# EAGLE schematic esp32 (EAGLE 9.3.0)
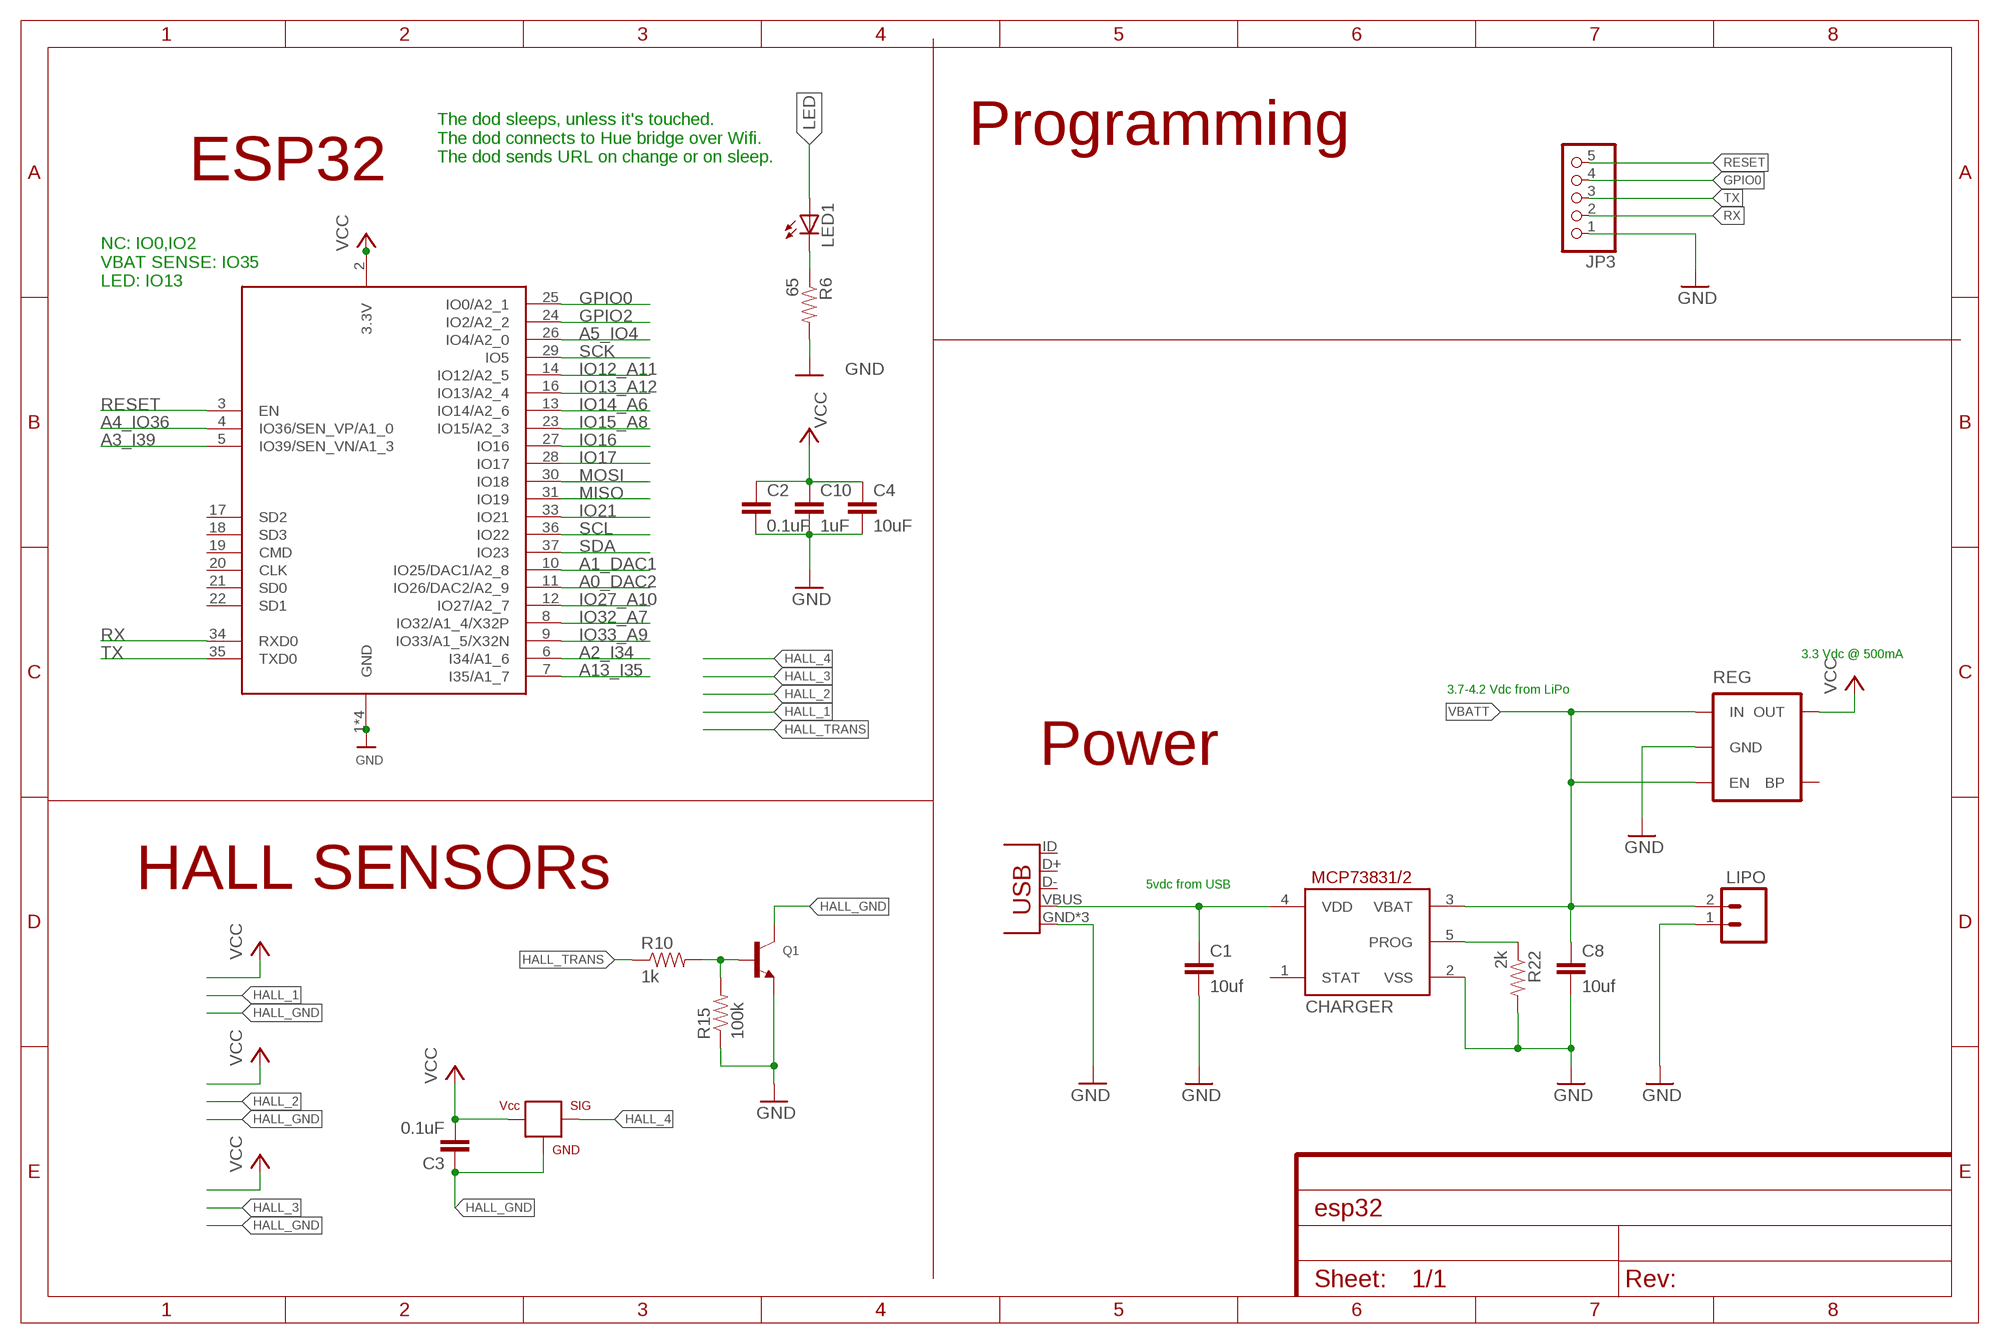
[diagram p0: schematic, sheet 1]

## Parts
C1  10uf  CAP0603-CAP  [0603-CAP]
C2  0.1uF  CAP0402-CAP  [0402-CAP]
C3  0.1uF  CAP0603-CAP  [0603-CAP]
C4  10uF  CAP0402-CAP  [0402-CAP]
C8  10uf  CAP0603-CAP  [0603-CAP]
C10  1uF  CAP0402-CAP  [0402-CAP]
CHARGER  MCP73831/OT  [SOT23-5L]
HALL  HALLEFFECT-A1326  [SOT23-3]
JP1  USB-MICROB  [USB-MICROB]
JP3  PINHD-1X55X2MM  [1_05X2MM]
LED1  LEDCHIPLED_0603  [CHIPLED_0603]
LIPO  M02  [1X02_LONGPADS]
Q1  TRANSISTOR_NPN  [SOT-23-R]
R6  65  RESISTOR0805-RES  [0805]
R10  1k  RESISTOR0402-RES  [0402-RES]
R15  100k  RESISTOR0402-RES  [0402-RES]
R22  2k  RESISTOR0402-RES  [0402-RES]
REG  MIC52053.3V  [SOT23-5]
X2  ESP32_WROOM32_SKINNY  [WROOM32_SKINNY]

## Nets
5V: C1.1 CHARGER.4(VDD) JP1.VBUS
A0_DAC2: X2.11(IO26/DAC2/A2_9)
A1_DAC1: X2.10(IO25/DAC1/A2_8)
A2_I34: X2.6(I34/A1_6)
A3_I39: X2.5(IO39/SEN_VN/A1_3)
A4_IO36: X2.4(IO36/SEN_VP/A1_0)
A5_IO4: X2.26(IO4/A2_0)
A13_I35: X2.7(I35/A1_7)
GND: C1.2 C2.2 C4.2 C8.2 C10.2 CHARGER.2(VSS) JP1.GND JP1.MT1(GND) JP1.MT2(GND) JP3.1 LIPO.1 Q1.3-EMITTER(E) R6.2 R15.1 R22.2 REG.2(GND) X2.1(GND) X2.15(GND) X2.38(GND) X2.P$1(GND)
GPIO0: JP3.4 X2.25(IO0/A2_1)
GPIO2: X2.24(IO2/A2_2)
HALL_4: HALL.2(SIG)
HALL_GND: C3.1 HALL.3(GND) Q1.2-COLLECTOR(C)
HALL_TRANS: R10.1
IO12_A11: X2.14(IO12/A2_5)
IO13_A12: X2.16(IO13/A2_4)
IO14_A6: X2.13(IO14/A2_6)
IO15_A8: X2.23(IO15/A2_3)
IO16: X2.27(IO16)
IO17: X2.28(IO17)
IO21: X2.33(IO21)
IO27_A10: X2.12(IO27/A2_7)
IO32_A7: X2.8(IO32/A1_4/X32P)
IO33_A9: X2.9(IO33/A1_5/X32N)
LED: LED1.A
MISO: X2.31(IO19)
MOSI: X2.30(IO18)
N$1: LED1.C R6.1
N$2: CHARGER.5(PROG) R22.1
N$5: Q1.1-BASE(B) R10.2 R15.2
RESET: JP3.5 X2.3(EN)
RX: JP3.2 X2.34(RXD0)
SCK: X2.29(IO5)
SCL: X2.36(IO22)
SDA: X2.37(IO23)
TX: JP3.3 X2.35(TXD0)
VBATT: C8.1 CHARGER.3(VBAT) LIPO.2 REG.1(IN) REG.3(EN)
VCC: C2.1 C3.2 C4.1 C10.1 HALL.1(VCC) REG.5(OUT) X2.2(3.3V)
Unconnected: CHARGER.1(STAT) JP1.D+ JP1.D- JP1.ID(SHIELD) REG.4(BP) X2.17(SD2) X2.18(SD3) X2.19(CMD) X2.20(CLK) X2.21(SD0) X2.22(SD1)

## Notes on the sheet
- Programming
- The dod sleeps, unless it's touched.
  The dod connects to Hue bridge over Wifi.
  The dod sends URL on change or on sleep.
- ESP32
- NC: IO0,IO2
  VBAT SENSE: IO35
  LED: IO13
- 3.3 Vdc @ 500mA
- 3.7-4.2 Vdc from LiPo
- Power
- HALL SENSORs | 5vdc from USB

## Library data of the parts
C1 C8 = SparkFun-Capacitors:CAP: Capacitor Standard 0603 ceramic capacitor, and 0.1" leaded capacitor.
C2-C4 C10 = SparkFun:CAP: Capacitor Standard 0603 ceramic capacitor, and 0.1" leaded capacitor.
CHARGER = adafruit:MCP73831: MCP73831/2 Miniature Single-Cell, Fully Integrated Li-Ion, Li-Polymer Charge Management Controllers. Nice and small simple lipoly charge controller, with adjustable current and status output (LED) http://www.ladyada.net/library/pcb/eaglelibrary.html
HALL = Andy_Sigler:HALLEFFECT-A1326
JP1 = Andy_Sigler:USB: USB Connectors USB-B-PTH is fully proven SKU : PRT-00139/CONN-08278 USB-miniB is fully proven SKU : PRT-00587 USB-A-PCB is untested. USB-A-H is throughly reviewed, but untested. Spark Fun Electronics SKU : PRT-00437 USB-B-SMT is throughly reviewed, but untested. Needs silkscreen touching up. USB-A-S has not been used/tested USB-MB-H has not been used/tested USB-MICROB has been used. CONN-09505; PROD_ID: CONN-09505
JP3 = pinhead:PINHD-1X5: PIN HEADER
LED1 = adafruit:LED: LED OSRAM: - CHIPLED LG R971, LG N971, LY N971, LG Q971, LY Q971, LO R971, LY R971 LH N974, LH R974 LS Q976, LO Q976, LY Q976 LO Q996 - Hyper CHIPLED LW Q18S LB Q993, LB Q99A, LB R99A - SideLED LS A670, LO A670, LY A670, LG A670, LP A670 LB A673, LV A673, LT A673, LW A673 LH A674 LY A675 LS A676, LA A676, LO A676, LY A676, LW A676 LS A679, LY A679, LG A679 - Hyper Micro SIDELED® LS Y876, LA Y876, LO Y876, LY Y876 LT Y87S - SmartLED LW L88C, LW L88S LB L89C, LB L89S, LG L890 LS L89K, LO L89K, LY L89K LS L896, LA L896, LO L896, LY L896 - TOPLED LS T670, LO T670, LY T670, LG T670, LP T670 LSG T670, LSP T670, LSY T670, LOP T670, LYG T670 LG T671, LOG T671, LSG T671 LB T673, LV T673, LT T673, LW T673 LH T674 LS T676, LA T676, LO T676, LY T676, LB T676, LH T676, LSB T676, LW T676 LB T67C, LV T67C, LT T67C, LS T67K, LO T67K, LY T67K, LW E67C LS E67B, LA E67B, LO E67B, LY E67B, LB E67C, LV E67C, LT E67C LW T67C LS T679, LY T679, LG T679 LS T770, LO T770, LY T770, LG T770, LP T770 LB T773, LV T773, LT T773, LW T773 LH T774 LS E675, LA E675, LY E675, LS T675 LS T776, LA T776, LO T776, LY T776, LB T776 LHGB T686 LT T68C, LB T68C - Hyper Mini TOPLED® LB M676 - Mini TOPLED Santana® LG M470 LS M47K, LO M47K, LY M47K Source: http://www.osram.convergy.de/
LIPO = SparkFun:M02: Header 2 Standard 2-pin 0.1" header. Use with straight break away headers (SKU : PRT-00116), right angle break away headers (PRT-00553), swiss pins (PRT-00743), machine pins (PRT-00117), and female headers (PRT-00115). Molex polarized connector foot print use with SKU : PRT-08233 with associated crimp pins and housings.
Q1 = Tomorrow_Lab_LLC:TRANSISTOR_NPN: NPN Transistor Transistor (NPN) 500mA 45V - BC817 [Digikey: 568-1631-1-ND] SOT23-R - SOT23 footprint optimised for use with solder paste and reflow ovens. SOT23-W - SOT23 footprint optimised for hand-soldering (larger pads).
R6 = SparkFun-Resistors:RESISTOR: Resistor Basic schematic elements and footprints for 0603, 1206, and PTH resistors.
R10 R15 R22 = SparkFun-Passives:RESISTOR: Resistor Basic schematic elements and footprints for 0603, 1206, and PTH resistors.
REG = SparkFun-PowerIC:MIC5205: MIC5205 150mA vreg 3.3V - VREG-00822 5V - VREG-00823; PROD_ID: VREG-00822
X2 = microbuilder:ESP32_WROOM32